# Altium schematic sheet Top.SchDoc
size A; SheetNumber: 1; SheetTotal: 4
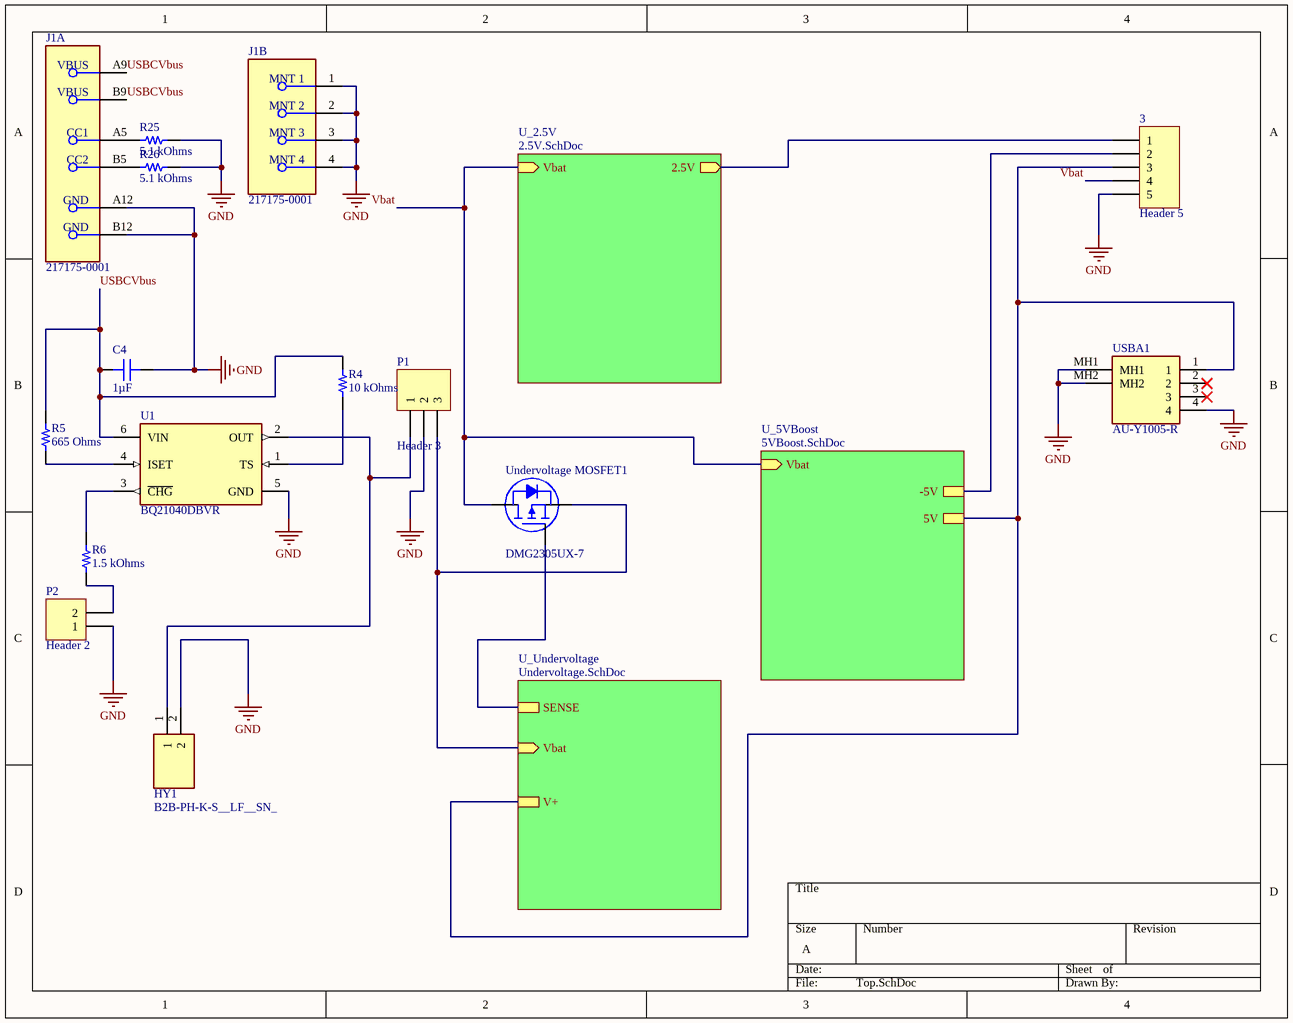
[diagram p0: Top.SchDoc]

## Parts
3  Header 5  [HDR1X5]
C4  value 1µF  [CAP 0603_1608]  (hidden comment: 0603YC105MAT2A)
HY1  B2B-PH-K-S__LF__SN_  [B2BPHKSLFSN]
J1  217175-0001  [FP-217175-0001-MFG]  (parts A,B of 2)
P1  Header 3  [HDR1X3]
P2  Header 2  [HDR1X2]
R4  value 10 kOhms  [RES 0603_1608]  (hidden comment: RR0816P-103-D)
R5  value 665 Ohms  [RES 0603_1608]  (hidden comment: RK73H1JTTD6650F)
R6  value 1.5 kOhms  [RES 0603_1608]  (hidden comment: ERA-3AEB152V)
R25  value 5.1 kOhms  [RES 0603_1608]  (hidden comment: AC0603JR-075K1L)
R26  value 5.1 kOhms  [RES 0603_1608]  (hidden comment: AC0603JR-075K1L)
U1  BQ21040DBVR  [FP-DBV0006A-MFG]
Undervoltage_MOSFET1  DMG2305UX-7  [DIODES SOT-23-3]
USBA1  AU-Y1005-R  [AUY1005R]

## Sub-sheets
U_2.5V = 2.5V.SchDoc: Vbat (in), 2.5V (out)
U_5VBoost = 5VBoost.SchDoc: Vbat (in), 5V, -5V
U_Undervoltage = Undervoltage.SchDoc: Vbat (in), SENSE, V+

## Nets
GND: 3.5 C4.2 HY1.2 J1.1(MNT_1) J1.2(MNT_2) J1.3(MNT_3) J1.4(MNT_4) J1.A12(GND) J1.B12(GND) P1.2 P2.1 R25.2 R26.2 U1.5(GND) USBA1.4 USBA1.MH1 USBA1.MH2
USBCVbus: C4.1 J1.A9(VBUS) J1.B9(VBUS) R4.1 R5.2 U1.6(VIN)
Vbat: 3.4 Undervoltage_MOSFET1.3(D) ; sheet U_5VBoost/Vbat, sheet U_2.5V/Vbat
Net3_1: 3.1 ; sheet U_2.5V/2.5V
Net3_2: 3.2 ; sheet U_5VBoost/-5V
Net3_3: 3.3 USBA1.1 ; sheet U_5VBoost/5V, sheet U_Undervoltage/V+
NetHY1_1: HY1.1 P1.1 U1.2(OUT)
NetJ1_A5: J1.A5(CC1) R25.1
NetJ1_B5: J1.B5(CC2) R26.1
NetP1_3: P1.3 Undervoltage_MOSFET1.2(S) ; sheet U_Undervoltage/Vbat
NetP2_2: P2.2 R6.1
NetR4_2: R4.2 U1.1(TS)
NetR5_1: R5.1 U1.4(ISET)
NetR6_2: R6.2 U1.3(~{CHG})
NetUndervoltage_MOSFET1_1: Undervoltage_MOSFET1.1(G) ; sheet U_Undervoltage/SENSE

Not connected (* = marked no-connect by the designer): USBA1 2* 3*

## Library data of the parts
3 = CMP-002-000102-1: Header, 5-Pin; Signal Integrity: Connector; LatestRevisionDate: 17-Jul-2002; Source: Miscellaneous Connectors.SchLib; Design Item ID: Header 5; Publisher: Altium Limited; LatestRevisionNote: Re-released for DXP Platform.; Component Type: Standard; Pin Count: 5
C4 = CMP-184-001549-1: CAP CER 1UF 16V X7R 0603; manufacturer: AVX Corporation; Tolerance: ±20%; Part Status: Active; Applications: General Purpose; Operating Temperature: -55°C ~ 125°C; Minimum Order: 1; ComponentLink1URL: http://datasheets.avx.com/X7RDielectric.pdf; partid: 8799; series: -; Mounting Type: Surface Mount, MLCC; Size / Dimension: 0.063" L x 0.032" W (1.60mm x 0.81mm); lastupdated: 9/2/2020 1:03:24 AM; ComponentLink2Description: DigiKey Link; packaging: TapeAndReel; Capacitance: 1µF; price: 0.04; Device Package: 0603 (1608 Metric); Thickness (Max): 0.035" (0.90mm); Voltage - Rated: 16V; ComponentLink1Description: Datasheet; Part Number: 0603YC105MAT2A; Temperature Coefficient: X7R; Package / Case: 0603 (1608 Metric); ComponentLink2URL: http://digikey.com/product-detail/en/avx-corporation/0603YC105MAT2A/478-11645-1-ND/8564203; Lifecycle Status: Active
HY1 = B2B-PH-K-S__LF__SN_: Circulator or Directional Coupler; Manufacturer_Name: JST (JAPAN SOLDERLESS TERMINALS); Manufacturer_Part_Number: B2B-PH-K-S (LF)(SN); Datasheet Link: http://www.jst-mfg.com/product/pdf/eng/ePH.pdf; Height: 6mm
J1 = CMP-04767-000026-1: CONN RCP USB2.0 C 6+18P SMD RA
P1 = CMP-002-000090-1: Header, 3-Pin; Signal Integrity: Connector; Component Type: Standard; LatestRevisionDate: 17-Jul-2002; Publisher: Altium Limited; Design Item ID: Header 3; LatestRevisionNote: Re-released for DXP Platform.; Source: Miscellaneous Connectors.SchLib; Pin Count: 3
P2 = CMP-002-000070-1: Header, 2-Pin; Signal Integrity: Connector; Pin Count: 2; Component Type: Standard; Publisher: Altium Limited; Source: Miscellaneous Connectors.SchLib; LatestRevisionDate: 17-Jul-2002; Design Item ID: Header 2; LatestRevisionNote: Re-released for DXP Platform.
R4 = CMP-289-000281-1: RES SMD 10K OHM 0.5% 1/16W 0603; Manufacturer: Susumu; Power (Watts): 0.063W, 1/16W; Temperature Coefficient: ±25ppm/°C; Device Package: 0603 (1608 Metric); Resistance: 10 kOhms; Number of Terminations: 2; Height - Seated (Max): 0.020" (0.50mm); Composition: Thin Film; Size / Dimension: 0.063" L x 0.031" W (1.60mm x 0.80mm); Series: RR; PartId: 5458; Supplier Device Package: 0603; Part Number: RR0816P-103-D; ComponentLink1Description: Datasheet; Minimum Order: 1; Packaging: TapeAndReel; ComponentLink1URL: http://www.susumu.co.jp/common/pdf/n_catalog_partition05_en.pdf; ComponentLink2URL: https://www.digikey.com/en/products/detail/susumu/RR0816P-103-D/432209; Price: 0.01; LastUpdated: 9/19/2022 1:22:32 PM; Package / Case: 0603 (1608 Metric); Tolerance: ±0.5%; ComponentLink2Description: DigiKey Link; Lifecycle Status: Active; Part Status: Active; Operating Temperature: -55°C ~ 125°C
R5 = CMP-289-001928-1: RES 665 OHM 1% 1/8W 0603; Manufacturer: KOA Speer Electronics, Inc.; Temperature Coefficient: ±100ppm/°C; Power (Watts): 0.125W, 1/8W; Price: 0.01; Minimum Order: 1; Part Status: Active; Composition: Thick Film; Series: RK73H; Operating Temperature: -55°C ~ 155°C; Package / Case: 0603 (1608 Metric); Lifecycle Status: Active; Supplier Device Package: 0603; Height - Seated (Max): 0.022" (0.55mm); Features: Automotive AEC-Q200, Moisture Resistant; Resistance: 665 Ohms; Part Number: RK73H1JTTD6650F; Tolerance: ±1%; Packaging: CutTape; ComponentLink2URL: https://www.digikey.com/en/products/detail/koa-speer-electronics-inc/RK73H1JTTD6650F/9845256; Number of Terminations: 2; LastUpdated: 9/19/2022 1:22:19 PM; Ratings: AEC-Q200; ComponentLink1URL: http://www.koaspeer.com/catimages/Products/RK73H/RK73H.pdf; PartId: 8803; ComponentLink1Description: Datasheet; Device Package: 0603 (1608 Metric); Size / Dimension: 0.063" L x 0.031" W (1.60mm x 0.80mm); ComponentLink2Description: DigiKey Link
R6 = CMP-289-000334-1: RES SMD 1.5K OHM 0.1% 1/10W 0603; Manufacturer: Panasonic Electronic Components; Temperature Coefficient: ±25ppm/°C; Power (Watts): 0.1W, 1/10W; Operating Temperature: -55°C ~ 155°C; Height - Seated (Max): 0.022" (0.55mm); Price: 0.03; Features: Automotive AEC-Q200; Size / Dimension: 0.063" L x 0.031" W (1.60mm x 0.80mm); Lifecycle Status: Active; Supplier Device Package: 0603; Device Package: 0603 (1608 Metric); LastUpdated: 9/19/2022 1:22:32 PM; ComponentLink2Description: DigiKey Link; Tolerance: ±0.1%; Part Number: ERA-3AEB152V; Package / Case: 0603 (1608 Metric); Ratings: AEC-Q200; ComponentLink1Description: Datasheet; Packaging: TapeAndReel; Number of Terminations: 2; ComponentLink1URL: https://industrial.panasonic.com/cdbs/www-data/pdf/RDM0000/AOA0000C307.pdf; Resistance: 1.5 kOhms; Minimum Order: 1; PartId: 5573; ComponentLink2URL: https://www.digikey.com/en/products/detail/panasonic-electronic-components/ERA-3AEB152V/1465858; Composition: Thin Film; Part Status: Active; Series: ERA-3A
R25 R26 = CMP-289-001699-1: RES SMD 5.1K OHM 5% 1/10W 0603; Manufacturer: Yageo; Temperature Coefficient: ±100ppm/°C; Power (Watts): 0.1W, 1/10W; Ratings: AEC-Q200; ComponentLink2Description: DigiKey Link; Packaging: CutTape; Lifecycle Status: Active; Part Number: AC0603JR-075K1L; Resistance: 5.1 kOhms; Supplier Device Package: 0603; LastUpdated: 9/19/2022 1:22:21 PM; ComponentLink2URL: https://www.digikey.com/en/products/detail/yageo/AC0603JR-075K1L/5896480; ComponentLink1URL: https://www.yageo.com/upload/media/product/productsearch/datasheet/rchip/PYu-AC_51_RoHS_L_7.pdf; Part Status: Active; Composition: Thick Film; ComponentLink1Description: Datasheet; Package / Case: 0603 (1608 Metric); Device Package: 0603 (1608 Metric); Height - Seated (Max): 0.022" (0.55mm); Tolerance: ±5%; PartId: 8336; Minimum Order: 1; Price: 0.01; Operating Temperature: -55°C ~ 155°C; Number of Terminations: 2; Series: AC; Features: Automotive AEC-Q200, Moisture Resistant; Size / Dimension: 0.063" L x 0.031" W (1.60mm x 0.80mm)
U1 = CMP-04911-000045-1: IC BATT CHG LI-ION 1CELL SOT23-6; Differential Output: No; Settling Time: 30us; Fault Protection: Over Voltage; Number of Bits: 16; Output Type: Analog Current/Voltage; Interface: USB; Number of Cells: 1; Max Supply Voltage: 6.45V; Battery Pack Voltage: 4.2V; Max Charge Current: 800mA; Number of D/A Converters: 4; Mount: Surface Mount; Case/Package: SOT-23-6; RoHS Compliant: Yes; Packaging: Cut Tape; Min Operating Temperature: 0°C; Lead Free: Lead Free; Max Operating Temperature: 125°C
Undervoltage_MOSFET1 = CMP-258-000005-1: MOSFET P-CH 20V 4.2A SOT23; Manufacturer: Diodes Incorporated; Vgs(th) (Max) @ Id: 900mV @ 250µA; Drive Voltage (Max Rds On,  Min Rds On): 1.8V, 4.5V; Power Dissipation (Max): 1.4W (Ta); Rds On (Max) @ Id, Vgs: 52mOhm @ 4.2A, 4.5V; Vgs (Max): ±8V; Input Capacitance (Ciss) (Max) @ Vds: 808pF @ 15V; Current - Continuous Drain (Id) @ 25°C: 4.2A (Ta); Gate Charge (Qg) (Max) @ Vgs: 10.2nC @ 4.5V; FET Type: P-Channel; Minimum Order: 1; Part Number: DMG2305UX-7; Supplier Device Package: SOT-23; Price: 0.07; Drain to Source Voltage (Vdss): 20V; LastUpdated: 9/19/2022 2:00:16 PM; Packaging: TapeAndReel; Mounting Type: Surface Mount; ComponentLink2Description: DigiKey Link; Part Status: Active; ComponentLink2URL: http://digikey.com/product-detail/en/diodes-incorporated/DMG2305UX-7/DMG2305UX-7DICT-ND/4340665; Package / Case: TO-236-3, SC-59, SOT-23-3; Series: -; Lifecycle Status: Active; Technology: MOSFET (Metal Oxide); ComponentLink1URL: https://www.diodes.com/assets/Datasheets/DMG2305UX.pdf; Operating Temperature: -55°C ~ 150°C (TJ); ComponentLink1Description: Datasheet
USBA1 = AU-Y1005-R: Connector; Manufacturer_Name: ASSMANN WSW components GmbH; Datasheet Link: http://media.digikey.com/pdf/Data%20Sheets/Assmann%20PDFs/AU-Y1005-R_Dwg.pdf; Height: 7.8mm; Manufacturer_Part_Number: AU-Y1005-R